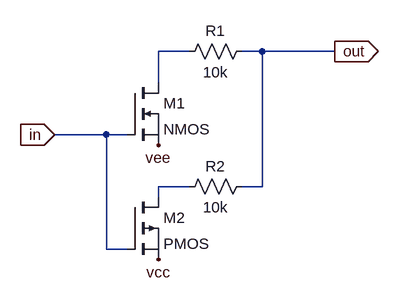
[diagram p0: schematic TNOT.asc]
TNOT.asc, the LTspice schematic file:
Version 4
SHEET 1 880 680
WIRE 144 80 96 80
WIRE 256 80 224 80
WIRE 368 80 256 80
WIRE 96 128 96 80
WIRE 16 208 -64 208
WIRE 48 208 16 208
WIRE 144 288 96 288
WIRE 256 288 256 80
WIRE 256 288 224 288
WIRE 96 304 96 288
WIRE 16 384 16 208
WIRE 48 384 16 384
FLAG 96 224 vee
FLAG 368 80 out
IOPIN 368 80 Out
FLAG 96 400 vcc
FLAG -64 208 in
IOPIN -64 208 In
SYMBOL nmos 48 128 R0
SYMATTR InstName M1
SYMBOL Res 240 64 R90
WINDOW 0 0 56 VBottom 2
WINDOW 3 32 56 VTop 2
SYMATTR InstName R1
SYMATTR Value 10k
SYMBOL pmos 48 304 R0
SYMATTR InstName M2
SYMBOL Res 240 272 R90
WINDOW 0 0 56 VBottom 2
WINDOW 3 32 56 VTop 2
SYMATTR InstName R2
SYMATTR Value 10k

The netlist it stands for:
* TNOT.asc
M1 N001 in vee vee NMOS
R1 out N001 10k
M2 N002 in vcc vcc PMOS
R2 out N002 10k
.model NMOS NMOS
.model PMOS PMOS
.lib standard.mos
.backanno
.end